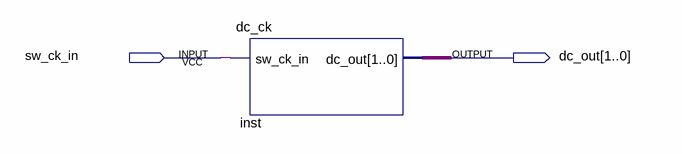
[diagram p0: schematic sheet]
// Quartus schematic dc_ck_bdf.bdf as structural Verilog: 1 symbols, 2 pins
module dc_ck_bdf (
  input  sw_ck_in,
  output [1:0] dc_out
);

  dc_ck inst (.sw_ck_in(sw_ck_in), .dc_out(dc_out));
endmodule
